# Altium schematic sheet Main.SchDoc
size A; SheetNumber: 1; SheetTotal: 7
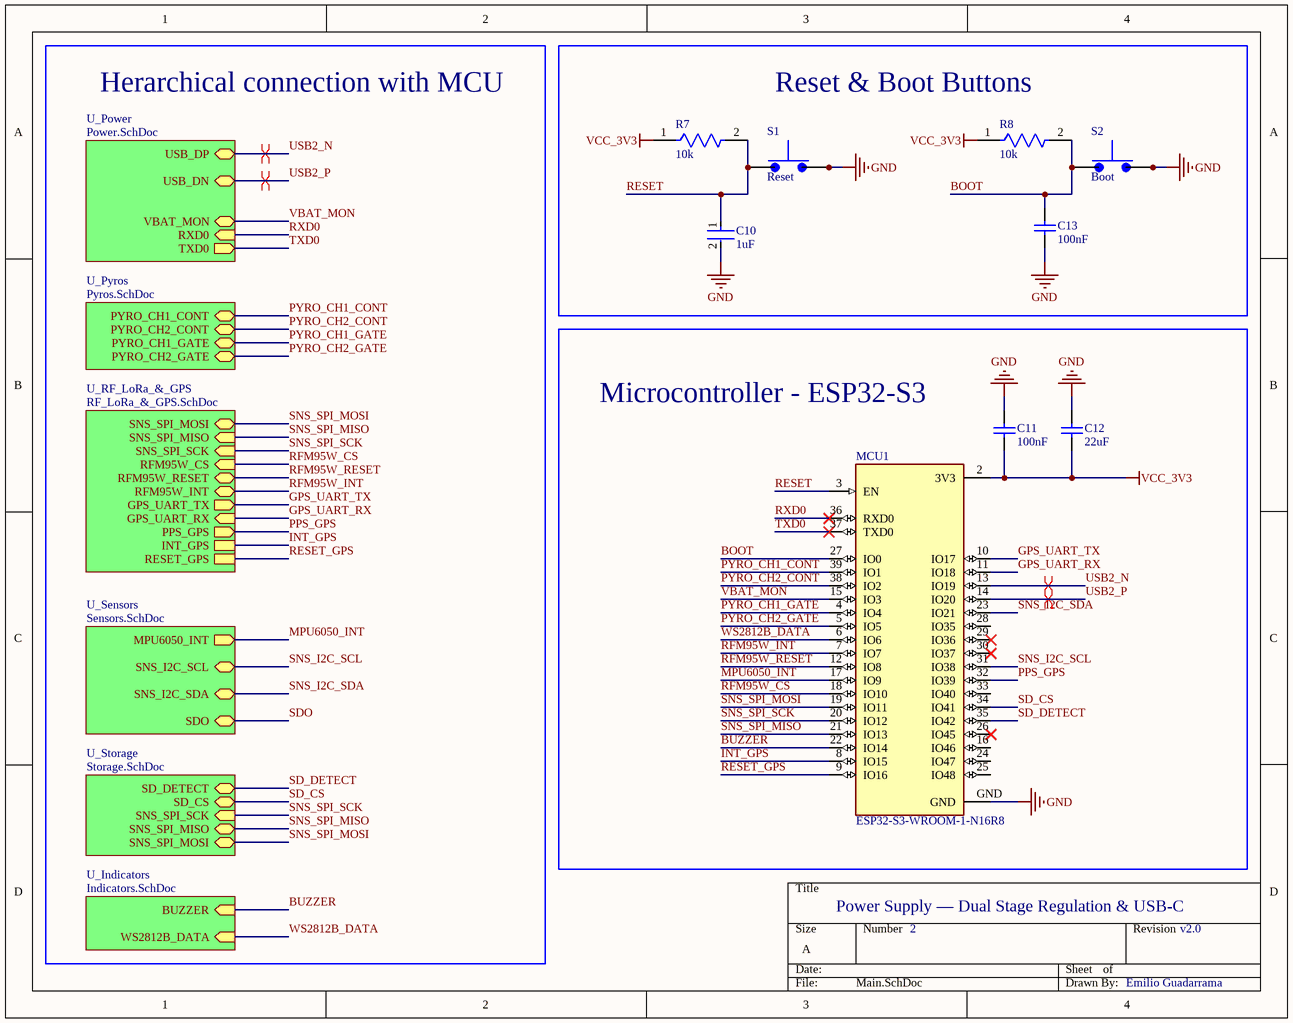
[diagram p0: Main.SchDoc]

## Parts
C10  1uF  [FP-0805-L_2_01_0_2-W_1_25-MFG]
C11  100nF  [CAPC2013X145X50NL20T25]
C12  22uF  [CAPC0805(2012)145_L]
C13  100nF  [CAPC2013X145X50NL20T25]
MCU1  ESP32-S3-WROOM-1-N16R8  [XCVR_ESP32-S3-WROOM-1-N16R2]
R7  10k  [FP-MCT0603-IPC_A]
R8  10k  [FP-MCT0603-IPC_A]
S1  Reset  [SW_SKRPABE010]
S2  Boot  [SW_SKRPABE010]

## Blocks framed on the sheet
Reset & Boot Buttons: C10 C13 R7 R8 S1 S2
Microcontroller - ESP32-S3: C11 C12 MCU1

## Sub-sheets
U_Indicators = Indicators.SchDoc: BUZZER (in), WS2812B_DATA (in)
U_Power = Power.SchDoc: RXD0 (in), TXD0 (out), VBAT_MON (bidir), USB_DP (bidir), USB_DN (bidir)
U_Pyros = Pyros.SchDoc: PYRO_CH2_CONT (bidir), PYRO_CH1_CONT (bidir), PYRO_CH2_GATE (bidir), PYRO_CH1_GATE (bidir)
U_RF_LoRa_&_GPS = RF_LoRa_&_GPS.SchDoc: SNS_SPI_MOSI (bidir), SNS_SPI_MISO (in), SNS_SPI_SCK (in), RFM95W_CS (in), RFM95W_RESET (bidir), RFM95W_INT (bidir), GPS_UART_TX (out), GPS_UART_RX (in), PPS_GPS (out), INT_GPS, RESET_GPS
U_Sensors = Sensors.SchDoc: MPU6050_INT (out), SNS_I2C_SCL (bidir), SNS_I2C_SDA (bidir), SDO (bidir)
U_Storage = Storage.SchDoc: SD_CS (bidir), SD_DETECT (bidir), SNS_SPI_MOSI (bidir), SNS_SPI_MISO (bidir), SNS_SPI_SCK (in)

## Nets
GND: C10.2 C11.2 C12.2 C13.1 MCU1.GND S1.3 S1.4 S2.3 S2.4
VCC_3V3: C11.1 C12.1 MCU1.2(3V3) R7.1 R8.1
BOOT: C13.2 MCU1.27(IO0) R8.2 S2.1 S2.2
BUZZER: MCU1.22(IO14) ; sheet U_Indicators/BUZZER
GPS_UART_RX: MCU1.11(IO18) ; sheet U_RF_LoRa_&_GPS/GPS_UART_RX
GPS_UART_TX: MCU1.10(IO17) ; sheet U_RF_LoRa_&_GPS/GPS_UART_TX
INT_GPS: MCU1.8(IO15) ; sheet U_RF_LoRa_&_GPS/INT_GPS
MPU6050_INT: MCU1.17(IO9) ; sheet U_Sensors/MPU6050_INT
PPS_GPS: MCU1.32(IO39) ; sheet U_RF_LoRa_&_GPS/PPS_GPS
PYRO_CH1_CONT: MCU1.39(IO1) ; sheet U_Pyros/PYRO_CH1_CONT
PYRO_CH1_GATE: MCU1.4(IO4) ; sheet U_Pyros/PYRO_CH1_GATE
PYRO_CH2_CONT: MCU1.38(IO2) ; sheet U_Pyros/PYRO_CH2_CONT
PYRO_CH2_GATE: MCU1.5(IO5) ; sheet U_Pyros/PYRO_CH2_GATE
RESET: C10.1 MCU1.3(EN) R7.2 S1.1 S1.2
RESET_GPS: MCU1.9(IO16) ; sheet U_RF_LoRa_&_GPS/RESET_GPS
RFM95W_CS: MCU1.18(IO10) ; sheet U_RF_LoRa_&_GPS/RFM95W_CS
RFM95W_INT: MCU1.7(IO7) ; sheet U_RF_LoRa_&_GPS/RFM95W_INT
RFM95W_RESET: MCU1.12(IO8) ; sheet U_RF_LoRa_&_GPS/RFM95W_RESET
RXD0: MCU1.36(RXD0) ; sheet U_Power/RXD0
SD_CS: MCU1.34(IO41) ; sheet U_Storage/SD_CS
SD_DETECT: MCU1.35(IO42) ; sheet U_Storage/SD_DETECT
SDO: sheet U_Sensors/SDO
SNS_I2C_SCL: MCU1.31(IO38) ; sheet U_Sensors/SNS_I2C_SCL
SNS_I2C_SDA: MCU1.23(IO21) ; sheet U_Sensors/SNS_I2C_SDA
SNS_SPI_MISO: MCU1.21(IO13) ; sheet U_Storage/SNS_SPI_MISO, sheet U_RF_LoRa_&_GPS/SNS_SPI_MISO
SNS_SPI_MOSI: MCU1.19(IO11) ; sheet U_Storage/SNS_SPI_MOSI, sheet U_RF_LoRa_&_GPS/SNS_SPI_MOSI
SNS_SPI_SCK: MCU1.20(IO12) ; sheet U_Storage/SNS_SPI_SCK, sheet U_RF_LoRa_&_GPS/SNS_SPI_SCK
TXD0: MCU1.37(TXD0) ; sheet U_Power/TXD0
USB2_N: MCU1.13(IO19) ; sheet U_Power/USB_DP
USB2_P: MCU1.14(IO20) ; sheet U_Power/USB_DN
VBAT_MON: MCU1.15(IO3) ; sheet U_Power/VBAT_MON
WS2812B_DATA: MCU1.6(IO6) ; sheet U_Indicators/WS2812B_DATA

Not connected (* = marked no-connect by the designer): MCU1 16(IO46) 24(IO47) 25(IO48) 26(IO45)* 28(IO35) 29(IO36)* 30(IO37)* 33(IO40)

## Layout directives
differential pair: USB2_N, USB2_P

## Notes on the sheet
- Herarchical connection with MCU
- Power Supply — Dual Stage Regulation & USB-C
- 2
- v2.0
- Emilio Guadarrama

## Library data of the parts
C10 = CMP-07738-122049624-1: 08051C105K4T2A Cap Ceramic 1uF 100V X7R 10% Pad SMD 0805 125C Automotive T/R; Capacitance: 1µF; Tolerance: 10%; Dielectric: X7R; Case/Package: 0805; Material: Ceramic; Height: 1.4mm; Voltage Rating (DC): 100V; Voltage Rating: 100V; Schedule B: 8532240020; NexarPartId: 122049624; RoHS: Compliant; Lifecycle Status: Production; Min Operating Temperature: -55°C; Max Operating Temperature: 125°C
C11 C13 = CMP-2007-01227-1: Manufacturer: Kemet; Part Number: C0805S104K5RACTU
C12 = CMP-1036-04938-1: CAP 22uF 6.3V ±10% 0805 (2012 Metric) Thickness 1.45mm SMD; Tolerance: Â±10%; Case-EIA: 0805; Case-Metric: 2012; Technology: SMT; Rated Voltage: 6.3 V; Max Thickness: 1.45 mm; Value: 22uF
MCU1 = ESP32-S3-WROOM-1-N16R2: Bluetooth, WiFi 802.11b/g/n, Bluetooth v5.0 Transceiver Module 2.4GHz PCB Trace Surface Mount; MF: Espressif Systems; MP: ESP32S3WROOM1N16R2; SnapEDA_Link: https://www.snapeda.com/parts/ESP32S3WROOM1N16R2/Espressif+Systems/view-part/?ref=snap; Package: NON STANDARD Espressif Systems; Value: *; Check_prices: https://www.snapeda.com/parts/ESP32S3WROOM1N16R2/Espressif+Systems/view-part/?ref=eda
R7 R8 = CMP-02407-011165-1: RES SMD 100 OHM 1% 1/8W 0603; Temperature Coefficient: 25ppm/°C; Resistance: 10kR; Power Rating: 125mW; Tolerance: 0.1%; Voltage Rating: 75V; Length: 1.55mm; Case Code (Imperial): 0603; Case/Package: 0603; Construction: Rectangular; Package Quantity: 1000; Number of Terminations: 2; Termination: SMD/SMT; Resistor Type: Thin Film; Features: Automotive AEC-Q200; Series: MCT 0603 - Precision; Max Operating Temperature: 155°C; Depth: 0.85mm; Max Power Dissipation: 125mW; Min Operating Temperature: -55°C; Width: 0.033inch; Case Code (Metric): 1608; Packaging: Tape and Reel; Weight: 6.7E-05oz; Military Standard: Not; Height: 0.022inch
S1 S2 = SKRPABE010: Switch Tactile N.O. SPST Button J-Bend 0.05A 16VDC 1.57N SMD Automotive T/R; MF: ALPS; SnapEDA_Link: https://www.snapeda.com/parts/SKRPABE010/ALPS/view-part/?ref=snap; Package: None; Value: *; MP: SKRPABE010; Check_prices: https://www.snapeda.com/parts/SKRPABE010/ALPS/view-part/?ref=eda